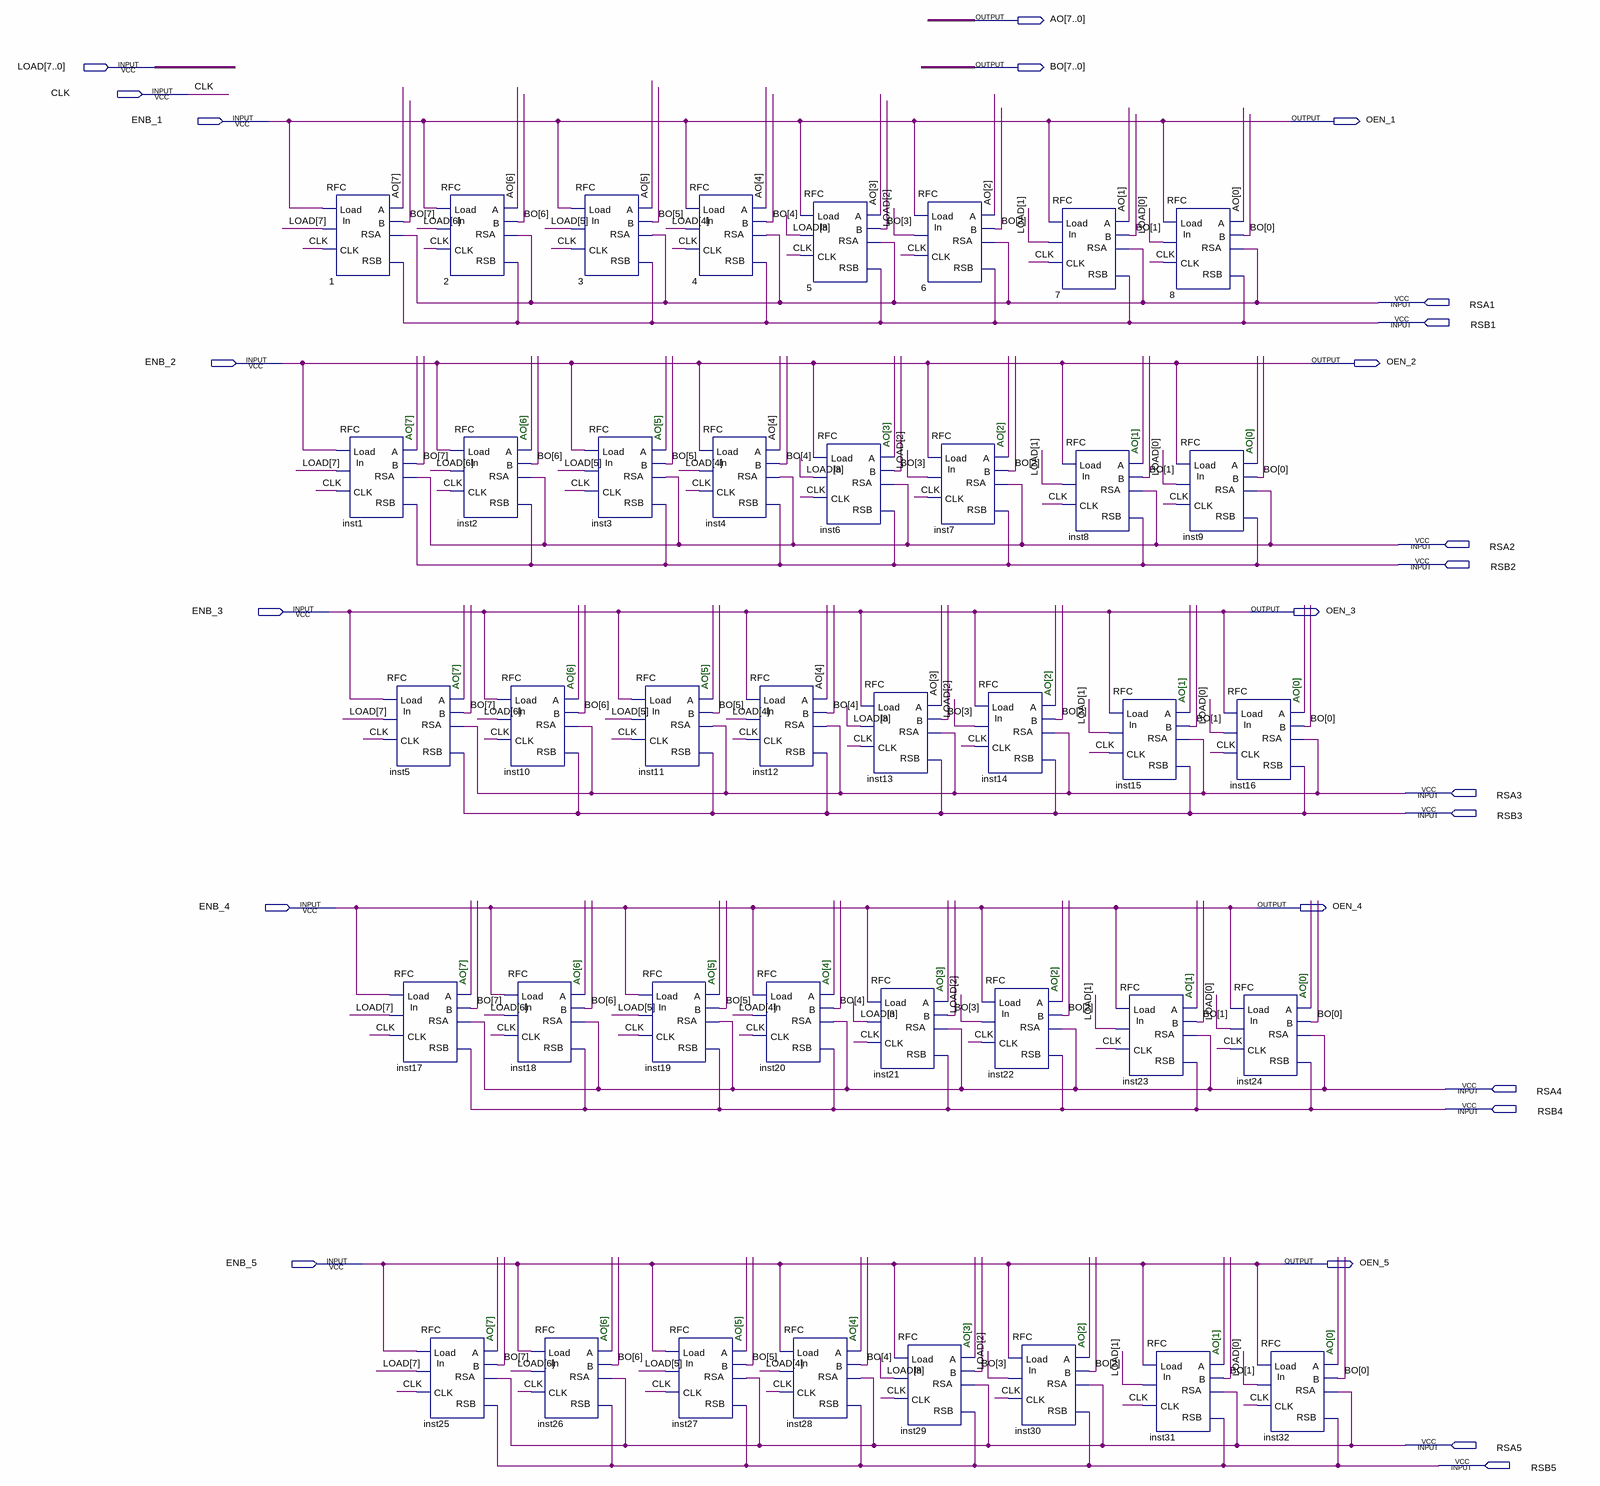
[diagram p0: schematic sheet]
// Quartus schematic RFILE_8BITS.bdf as structural Verilog: 40 symbols, 24 pins
module RFILE_8BITS (
  input  [7:0] LOAD,
  input  CLK,
  input  ENB_1,
  input  RSA1,
  input  RSB1,
  input  ENB_2,
  input  RSA2,
  input  RSB2,
  input  ENB_3,
  input  RSA3,
  input  RSB3,
  input  ENB_4,
  input  RSA4,
  input  RSB4,
  input  ENB_5,
  input  RSA5,
  input  RSB5,
  output [7:0] AO,
  output [7:0] BO,
  output OEN_1,
  output OEN_2,
  output OEN_3,
  output OEN_4,
  output OEN_5
);

  RFC u_1 (.Load(ENB_1), .RSA(RSA1), .In(LOAD[7]), .CLK(CLK), .RSB(RSB1), .A(AO[7]), .B(BO[7]));
  RFC inst1 (.Load(ENB_2), .RSA(RSA2), .In(LOAD[7]), .CLK(CLK), .RSB(RSB2), .A(AO[7]), .B(BO[7]));
  RFC inst5 (.Load(ENB_3), .RSA(RSA3), .In(LOAD[7]), .CLK(CLK), .RSB(RSB3), .A(AO[7]), .B(BO[7]));
  RFC inst17 (.Load(ENB_4), .RSA(RSA4), .In(LOAD[7]), .CLK(CLK), .RSB(RSB4), .A(AO[7]), .B(BO[7]));
  RFC inst25 (.Load(ENB_5), .RSA(RSA5), .In(LOAD[7]), .CLK(CLK), .RSB(RSB5), .A(AO[7]), .B(BO[7]));
  RFC u_2 (.Load(ENB_1), .RSA(RSA1), .In(LOAD[6]), .CLK(CLK), .RSB(RSB1), .A(AO[6]), .B(BO[6]));
  RFC inst2 (.Load(ENB_2), .RSA(RSA2), .In(LOAD[6]), .CLK(CLK), .RSB(RSB2), .A(AO[6]), .B(BO[6]));
  RFC inst10 (.Load(ENB_3), .RSA(RSA3), .In(LOAD[6]), .CLK(CLK), .RSB(RSB3), .A(AO[6]), .B(BO[6]));
  RFC inst18 (.Load(ENB_4), .RSA(RSA4), .In(LOAD[6]), .CLK(CLK), .RSB(RSB4), .A(AO[6]), .B(BO[6]));
  RFC u_3 (.Load(ENB_1), .RSA(RSA1), .In(LOAD[5]), .CLK(CLK), .RSB(RSB1), .A(AO[5]), .B(BO[5]));
  RFC inst26 (.Load(ENB_5), .RSA(RSA5), .In(LOAD[6]), .CLK(CLK), .RSB(RSB5), .A(AO[6]), .B(BO[6]));
  RFC inst3 (.Load(ENB_2), .RSA(RSA2), .In(LOAD[5]), .CLK(CLK), .RSB(RSB2), .A(AO[5]), .B(BO[5]));
  RFC inst11 (.Load(ENB_3), .RSA(RSA3), .In(LOAD[5]), .CLK(CLK), .RSB(RSB3), .A(AO[5]), .B(BO[5]));
  RFC u_4 (.Load(ENB_1), .RSA(RSA1), .In(LOAD[4]), .CLK(CLK), .RSB(RSB1), .A(AO[4]), .B(BO[4]));
  RFC inst19 (.Load(ENB_4), .RSA(RSA4), .In(LOAD[5]), .CLK(CLK), .RSB(RSB4), .A(AO[5]), .B(BO[5]));
  RFC inst27 (.Load(ENB_5), .RSA(RSA5), .In(LOAD[5]), .CLK(CLK), .RSB(RSB5), .A(AO[5]), .B(BO[5]));
  RFC inst4 (.Load(ENB_2), .RSA(RSA2), .In(LOAD[4]), .CLK(CLK), .RSB(RSB2), .A(AO[4]), .B(BO[4]));
  RFC inst12 (.Load(ENB_3), .RSA(RSA3), .In(LOAD[4]), .CLK(CLK), .RSB(RSB3), .A(AO[4]), .B(BO[4]));
  RFC inst20 (.Load(ENB_4), .RSA(RSA4), .In(LOAD[4]), .CLK(CLK), .RSB(RSB4), .A(AO[4]), .B(BO[4]));
  RFC inst28 (.Load(ENB_5), .RSA(RSA5), .In(LOAD[4]), .CLK(CLK), .RSB(RSB5), .A(AO[4]), .B(BO[4]));
  RFC u_5 (.Load(ENB_1), .RSA(RSA1), .In(LOAD[3]), .CLK(CLK), .RSB(RSB1), .A(AO[3]), .B(BO[3]));
  RFC inst6 (.Load(ENB_2), .RSA(RSA2), .In(LOAD[3]), .CLK(CLK), .RSB(RSB2), .A(AO[3]), .B(BO[3]));
  RFC inst13 (.Load(ENB_3), .RSA(RSA3), .In(LOAD[3]), .CLK(CLK), .RSB(RSB3), .A(AO[3]), .B(BO[3]));
  RFC inst21 (.Load(ENB_4), .RSA(RSA4), .In(LOAD[3]), .CLK(CLK), .RSB(RSB4), .A(AO[3]), .B(BO[3]));
  RFC inst29 (.Load(ENB_5), .RSA(RSA5), .In(LOAD[3]), .CLK(CLK), .RSB(RSB5), .A(AO[3]), .B(BO[3]));
  RFC u_6 (.Load(ENB_1), .RSA(RSA1), .In(LOAD[2]), .CLK(CLK), .RSB(RSB1), .A(AO[2]), .B(BO[2]));
  RFC inst7 (.Load(ENB_2), .RSA(RSA2), .In(LOAD[2]), .CLK(CLK), .RSB(RSB2), .A(AO[2]), .B(BO[2]));
  RFC inst14 (.Load(ENB_3), .RSA(RSA3), .In(LOAD[2]), .CLK(CLK), .RSB(RSB3), .A(AO[2]), .B(BO[2]));
  RFC inst22 (.Load(ENB_4), .RSA(RSA4), .In(LOAD[2]), .CLK(CLK), .RSB(RSB4), .A(AO[2]), .B(BO[2]));
  RFC inst30 (.Load(ENB_5), .RSA(RSA5), .In(LOAD[2]), .CLK(CLK), .RSB(RSB5), .A(AO[2]), .B(BO[2]));
  RFC u_7 (.Load(ENB_1), .RSA(RSA1), .In(LOAD[1]), .CLK(CLK), .RSB(RSB1), .A(AO[1]), .B(BO[1]));
  RFC inst8 (.Load(ENB_2), .RSA(RSA2), .In(LOAD[1]), .CLK(CLK), .RSB(RSB2), .A(AO[1]), .B(BO[1]));
  RFC inst15 (.Load(ENB_3), .RSA(RSA3), .In(LOAD[1]), .CLK(CLK), .RSB(RSB3), .A(AO[1]), .B(BO[1]));
  RFC inst23 (.Load(ENB_4), .RSA(RSA4), .In(LOAD[1]), .CLK(CLK), .RSB(RSB4), .A(AO[1]), .B(BO[1]));
  RFC u_8 (.Load(ENB_1), .RSA(RSA1), .In(LOAD[0]), .CLK(CLK), .RSB(RSB1), .A(AO[0]), .B(BO[0]));
  RFC inst31 (.Load(ENB_5), .RSA(RSA5), .In(LOAD[1]), .CLK(CLK), .RSB(RSB5), .A(AO[1]), .B(BO[1]));
  RFC inst9 (.Load(ENB_2), .RSA(RSA2), .In(LOAD[0]), .CLK(CLK), .RSB(RSB2), .A(AO[0]), .B(BO[0]));
  RFC inst16 (.Load(ENB_3), .RSA(RSA3), .In(LOAD[0]), .CLK(CLK), .RSB(RSB3), .A(AO[0]), .B(BO[0]));
  RFC inst24 (.Load(ENB_4), .RSA(RSA4), .In(LOAD[0]), .CLK(CLK), .RSB(RSB4), .A(AO[0]), .B(BO[0]));
  RFC inst32 (.Load(ENB_5), .RSA(RSA5), .In(LOAD[0]), .CLK(CLK), .RSB(RSB5), .A(AO[0]), .B(BO[0]));

  assign OEN_1 = ENB_1;
  assign OEN_2 = ENB_2;
  assign OEN_3 = ENB_3;
  assign OEN_4 = ENB_4;
  assign OEN_5 = ENB_5;

  // Notes on the sheet:
  //   AO[7]
  //   AO[6]
  //   AO[5]
  //   AO[3]
  //   AO[2]
  //   AO[1]
  //   AO[0]
  //   AO[7]
  //   AO[6]
  //   AO[5]
  //   AO[2]
  //   AO[1]
  //   AO[0]
  //   AO[7]
  //   AO[6]
  //   AO[5]
  //   AO[4]
  //   AO[3]
  //   AO[2]
  //   AO[1]
  //   AO[0]
  //   AO[7]
  //   AO[6]
  //   AO[5]
  //   AO[4]
  //   AO[3]
  //   AO[2]
  //   AO[1]
  //   AO[0]
endmodule
